# Altium schematic sheet CAN_I2C.SchDoc
size 420 x 297 mm; SheetNumber: 11; SheetTotal: 20
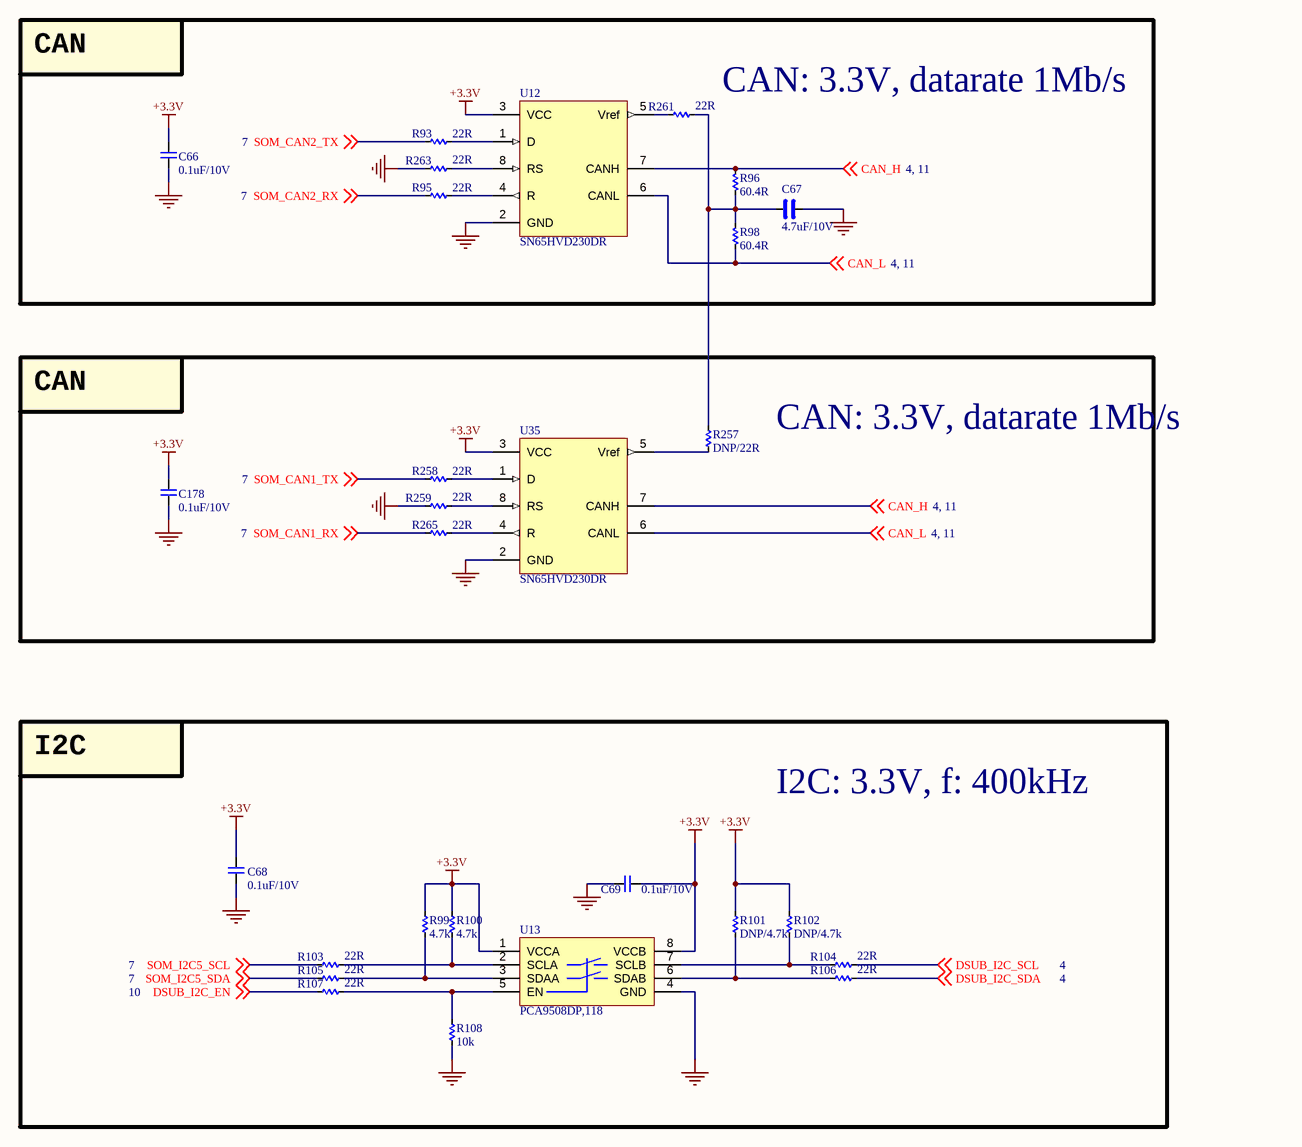
[diagram p0: CAN_I2C.SchDoc]

## Parts
C66  0.1uF/10V  [CAP_C_1005X60]
C67  4.7uF/10V  [CAP_C_1608X80]
C68  0.1uF/10V  [CAP_C_1005X60]
C69  0.1uF/10V  [CAP_C_1005X60]
C178  0.1uF/10V  [CAP_C_1005X60]
R93  22R  [RES_C_1005X40]
R95  22R  [RES_C_1005X40]
R96  60.4R  [RES_C_1005X40]
R98  60.4R  [RES_C_1005X40]
R99  4.7k  [RES_C_1005X40]
R100  4.7k  [RES_C_1005X40]
R101  DNP/4.7k  [RES_C_1005X40]
R102  DNP/4.7k  [RES_C_1005X40]
R103  22R  [RES_C_1005X40]
R104  22R  [RES_C_1005X40]
R105  22R  [RES_C_1005X40]
R106  22R  [RES_C_1005X40]
R107  22R  [RES_C_1005X40]
R108  10k  [RES_C_1005X40]
R257  DNP/22R  [RES_C_1005X40]
R258  22R  [RES_C_1005X40]
R259  22R  [RES_C_1005X40]
R261  22R  [RES_C_1005X40]
R263  22R  [RES_C_1005X40]
R265  22R  [RES_C_1005X40]
U12  SN65HVD230DR  [SOIC127P602X173-8N]
U13  PCA9508DP,118  [TSOP8]
U35  SN65HVD230DR  [SOIC127P602X173-8N]

## Blocks framed on the sheet
CAN: 3.3V, datarate 1Mb/s: C66 C67 R93 R95 R96 R98 R261 R263 U12
CAN: 3.3V, datarate 1Mb/s: C178 R257-R259 R265 U35
I2C: 3.3V, f: 400kHz: C68 C69 R99-R108 U13

## Nets
+3.3V: C66.2 C68.2 C69.1 C178.2 R99.1 R100.1 R101.1 R102.1 U12.3(VCC) U13.1(VCCA) U13.8(VCCB) U35.3(VCC)
GND: C66.1 C67.1 C68.1 C69.2 C178.1 R108.1 R259.2 R263.2 U12.2(GND) U13.4(GND) U35.2(GND)
CAN_H: R96.2 U12.7(CANH) U35.7(CANH) ; off-sheet CAN_H
CAN_L: R98.1 U12.6(CANL) U35.6(CANL) ; off-sheet CAN_L
DSUB_I2C_EN: R107.2 ; off-sheet DSUB_I2C_EN
DSUB_I2C_SCL: R104.1 ; off-sheet DSUB_I2C_SCL
DSUB_I2C_SDA: R106.1 ; off-sheet DSUB_I2C_SDA
SOM_CAN1_RX: R265.1 ; off-sheet SOM_CAN1_RX
SOM_CAN1_TX: R258.1 ; off-sheet SOM_CAN1_TX
SOM_CAN2_RX: R95.1 ; off-sheet SOM_CAN2_RX
SOM_CAN2_TX: R93.1 ; off-sheet SOM_CAN2_TX
SOM_I2C5_SCL: R103.2 ; off-sheet SOM_I2C5_SCL
SOM_I2C5_SDA: R105.2 ; off-sheet SOM_I2C5_SDA
NetC67_2: C67.2 R96.1 R98.2 R257.1 R261.1
NetR93_2: R93.2 U12.1(D)
NetR95_2: R95.2 U12.4(R)
NetR99_2: R99.2 R105.1 U13.3(SDAA)
NetR100_2: R100.2 R103.1 U13.2(SCLA)
NetR101_2: R101.2 R106.2 U13.6(SDAB)
NetR102_2: R102.2 R104.2 U13.7(SCLB)
NetR107_1: R107.1 R108.2 U13.5(EN)
NetR257_2: R257.2 U35.5(Vref)
NetR258_2: R258.2 U35.1(D)
NetR259_1: R259.1 U35.8(RS)
NetR261_2: R261.2 U12.5(Vref)
NetR263_1: R263.1 U12.8(RS)
NetR265_2: R265.2 U35.4(R)

## Notes on the sheet
- CAN
- I2C
- Project:
- Sub-system:
- Design by:
- Sheet title:
- Sheet
- of
- Checked by:
- Approved by:
- Revision:
- Document No:
- Size:
- Date:
- A3

## Library data of the parts
C66 C68 C69 C178 = _CAP_C_2: CAP CHIP
C67 = _CAP_C_High_2: CAP CHIP High Value
R93 R95 R96 R98-R108 R257-R259 R261 R263 R265 = _RES_B_2: RES
U12 U35 = IC_CAN_SN65HVD230DR: IC TRANSCEIVER HALF 1/1 8SOIC